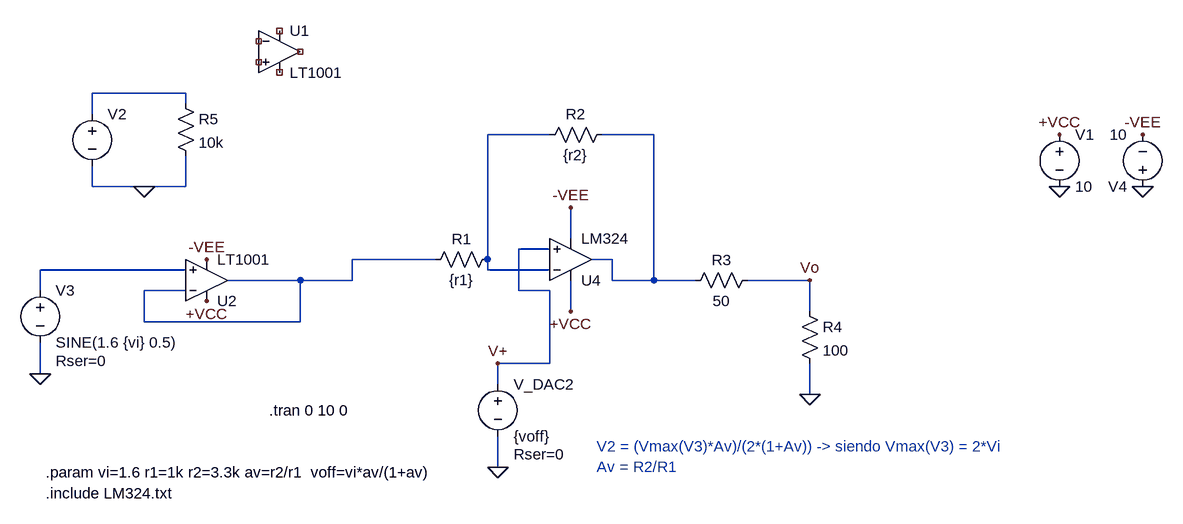
[diagram p0: schematic amplificador_pruebas_off.asc]
amplificador_pruebas_off.asc, the LTspice schematic file:
Version 4
SHEET 1 19688 680
WIRE -480 -144 -624 -144
WIRE -480 -128 -480 -144
WIRE -624 -112 -624 -144
WIRE 80 -80 -16 -80
WIRE 240 -80 160 -80
WIRE -624 0 -624 -32
WIRE -544 0 -624 0
WIRE -480 0 -480 -48
WIRE -480 0 -544 0
WIRE 112 80 112 32
WIRE 80 96 32 96
WIRE -96 112 -224 112
WIRE -16 112 -16 -80
WIRE 176 112 144 112
WIRE -480 128 -704 128
WIRE -16 128 -16 112
WIRE 80 128 -16 128
WIRE -304 144 -416 144
WIRE -224 144 -224 112
WIRE -224 144 -304 144
WIRE 176 144 176 112
WIRE 240 144 240 -80
WIRE 240 144 176 144
WIRE 304 144 240 144
WIRE 480 144 384 144
WIRE -704 160 -704 128
WIRE -480 160 -544 160
WIRE 32 160 32 96
WIRE 80 160 32 160
WIRE 112 192 112 144
WIRE 480 192 480 144
WIRE -544 208 -544 160
WIRE -304 208 -304 144
WIRE -304 208 -544 208
WIRE 80 272 80 160
WIRE 80 272 0 272
WIRE -704 288 -704 240
WIRE 0 304 0 272
WIRE 480 320 480 272
WIRE 0 432 0 384
FLAG 112 192 +VCC
FLAG 864 0 0
FLAG 864 -80 +VCC
FLAG -704 288 0
FLAG 992 0 0
FLAG 992 -80 -VEE
FLAG 112 32 -VEE
FLAG 480 320 0
FLAG 0 432 0
FLAG -448 176 +VCC
FLAG -448 112 -VEE
FLAG 0 272 V+
FLAG 480 144 Vo
FLAG -544 0 0
SYMBOL voltage 864 -96 R0
WINDOW 123 0 0 Left 2
WINDOW 39 0 0 Left 2
SYMATTR InstName V1
SYMATTR Value 10
SYMBOL voltage -704 144 R0
WINDOW 123 0 0 Left 2
WINDOW 39 24 124 Left 2
SYMATTR SpiceLine Rser=0
SYMATTR InstName V3
SYMATTR Value SINE(1.6 {vi} 0.5)
SYMBOL res 0 96 R90
WINDOW 0 0 56 VBottom 2
WINDOW 3 32 56 VTop 2
SYMATTR InstName R1
SYMATTR Value {r1}
SYMBOL res 176 -96 R90
WINDOW 0 0 56 VBottom 2
WINDOW 3 32 56 VTop 2
SYMATTR InstName R2
SYMATTR Value {r2}
SYMBOL res 400 128 R90
WINDOW 0 0 56 VBottom 2
WINDOW 3 32 56 VTop 2
SYMATTR InstName R3
SYMATTR Value 50
SYMBOL voltage 992 16 R180
WINDOW 123 0 0 Left 2
WINDOW 39 0 0 Left 2
SYMATTR InstName V4
SYMATTR Value 10
SYMBOL Opamps\\LT1001 -336 -272 R0
SYMATTR InstName U1
SYMBOL res 464 176 R0
SYMATTR InstName R4
SYMATTR Value 100
SYMBOL voltage 0 288 R0
WINDOW 123 0 0 Left 2
WINDOW 39 24 124 Left 2
SYMATTR SpiceLine Rser=0
SYMATTR InstName V_DAC2
SYMATTR Value {voff}
SYMBOL Opamps\\LT1001 -448 208 M180
SYMATTR InstName U2
SYMBOL Opamps\\opamp2 112 176 M180
SYMATTR InstName U4
SYMATTR Value LM324
SYMBOL res -496 -144 R0
SYMATTR InstName R5
SYMATTR Value 10k
SYMBOL voltage -624 -128 R0
WINDOW 3 24 96 Invisible 2
SYMATTR InstName V2
SYMATTR Value PWL TIME_SCALE_FACTOR=1 VALUE_SCALE_FACTOR=1 REPEAT FOREVER (file=senialDAC_0a3.3V_199puntos_escalon.txt) ENDREPEAT
TEXT -352 344 Left 2 !.tran 0 10 0
TEXT 152 400 Left 2 ;V2 = (Vmax(V3)*Av)/(2*(1+Av)) -> siendo Vmax(V3) = 2*Vi\nAv = R2/R1
TEXT -696 440 Left 2 !.param vi=1.6 r1=1k r2=3.3k av=r2/r1  voff=vi*av/(1+av)
TEXT -696 472 Left 2 !.include LM324.txt

The netlist it stands for:
* amplificador_pruebas_off.asc
V1 +VCC 0 10
V3 N005 0 SINE(1.6 {vi} 0.5) Rser=0
R1 N002 N004 {r1}
R2 N003 N002 {r2}
R3 Vo N003 50
V4 0 -VEE 10
XU1 NC_01 NC_02 NC_03 NC_04 NC_05 LT1001  ; pins In+ In- V+ V- OUT
R4 Vo 0 100
V_DAC2 V+ 0 {voff} Rser=0
XU2 N005 N004 +VCC -VEE N004 LT1001  ; pins In+ In- V+ V- OUT
XU4 V+ N002 +VCC -VEE N003 LM324  ; pins In+ In- V+ V- OUT
R5 N001 0 10k
V2 N001 0 PWL TIME_SCALE_FACTOR=1 VALUE_SCALE_FACTOR=1 REPEAT FOREVER (file=senialDAC_0a3.3V_199puntos_escalon.txt) ENDREPEAT
.tran 0 10 0
* V2 = (Vmax(V3)*Av)/(2*(1+Av)) -> siendo Vmax(V3) = 2*Vi
* Av = R2/R1
.param vi=1.6 r1=1k r2=3.3k av=r2/r1  voff=vi*av/(1+av)
.include LM324.txt
.lib LTC.lib
.backanno
.end